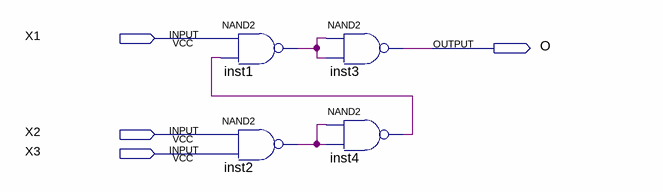
[diagram p0: schematic sheet]
// Quartus schematic AND3_NAND.bdf as structural Verilog: 4 symbols, 4 pins
module AND3_NAND (
  input  X1,
  input  X2,
  input  X3,
  output O
);

  wire inst1_out, inst2_out, inst4_out;

  nand inst1 (inst1_out, X1, inst4_out);
  nand inst2 (inst2_out, X2, X3);
  nand inst3 (O, inst1_out, inst1_out);
  nand inst4 (inst4_out, inst2_out, inst2_out);
endmodule
